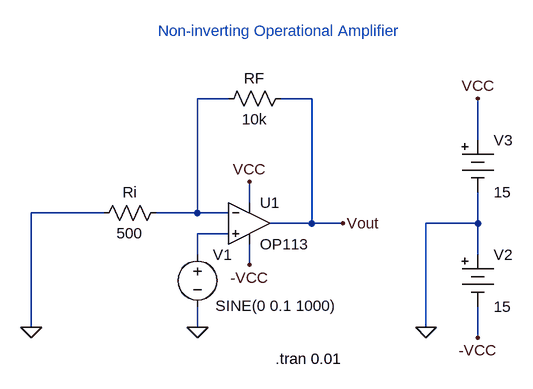
[diagram p0: schematic 2EEB_VELASCO_EXPT10_CKT5.asc]
2EEB_VELASCO_EXPT10_CKT5.asc, the LTspice schematic file:
Version 4
SHEET 1 880 680
WIRE 384 -80 336 -80
WIRE 512 -80 464 -80
WIRE 768 -16 768 -80
WIRE 416 80 416 48
WIRE 192 96 80 96
WIRE 336 96 336 -80
WIRE 336 96 272 96
WIRE 384 96 336 96
WIRE 512 112 512 -80
WIRE 512 112 448 112
WIRE 560 112 512 112
WIRE 768 112 768 64
WIRE 768 112 688 112
WIRE 384 128 336 128
WIRE 336 160 336 128
WIRE 768 160 768 112
WIRE 416 176 416 144
WIRE 80 272 80 96
WIRE 336 272 336 240
WIRE 688 272 688 112
WIRE 768 288 768 240
FLAG 80 272 0
FLAG 336 272 0
FLAG 560 112 Vout
FLAG 416 176 -VCC
FLAG 416 48 VCC
FLAG 688 272 0
FLAG 768 -80 VCC
FLAG 768 288 -VCC
SYMBOL res 288 80 R90
WINDOW 0 0 56 VBottom 2
WINDOW 3 32 56 VTop 2
SYMATTR InstName Ri
SYMATTR Value 500
SYMBOL OpAmps\\OP113 416 48 R0
SYMATTR InstName U1
SYMBOL res 368 -64 R270
WINDOW 0 32 56 VTop 2
WINDOW 3 0 56 VBottom 2
SYMATTR InstName RF
SYMATTR Value 10k
SYMBOL Misc\\battery 768 144 R0
SYMATTR InstName V2
SYMATTR Value 15
SYMBOL Misc\\battery 768 -32 R0
SYMATTR InstName V3
SYMATTR Value 15
SYMBOL voltage 336 144 R0
WINDOW 3 121 110 Bottom 2
SYMATTR InstName V1
SYMATTR Value SINE(0 0.1 1000)
TEXT 464 -184 Center 2 ;Non-inverting Operational Amplifier
TEXT 456 320 Left 2 !.tran 0.01

The netlist it stands for:
* 2EEB_VELASCO_EXPT10_CKT5.asc
Ri N001 0 500
XU1 N002 N001 VCC -VCC Vout OP113  ; pins In+ In- V+ V- OUT
RF N001 Vout 10k
V2 0 -VCC 15
V3 VCC 0 15
V1 N002 0 SINE(0 0.1 1000)
* Non-inverting Operational Amplifier
.tran 0.01
.lib ADI.lib
.backanno
.end